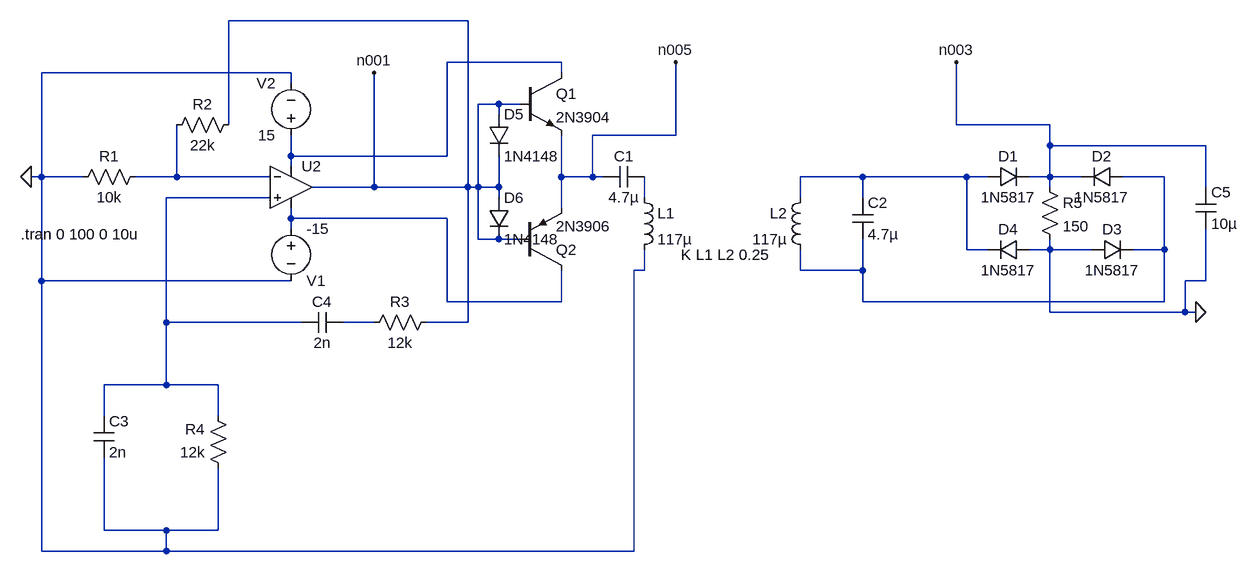
[diagram p0: schematic final simulation.asc]
final simulation.asc, the LTspice schematic file:
Version 4.1
SHEET 1 1472 960
WIRE -128 -128 -496 -128
WIRE 16 -64 -160 -64
WIRE -400 -48 -784 -48
WIRE 16 -48 16 -64
WIRE -400 -32 -400 -48
WIRE -80 0 -112 0
WIRE -48 0 -80 0
WIRE -80 16 -80 0
WIRE -496 32 -496 -128
WIRE 624 32 624 -64
WIRE 768 32 624 32
WIRE 192 48 192 -64
WIRE 192 48 64 48
WIRE 768 64 768 32
WIRE 1008 64 768 64
WIRE -400 80 -400 48
WIRE -160 80 -160 -64
WIRE -160 80 -400 80
WIRE -400 96 -400 80
WIRE -784 112 -784 -48
WIRE -784 112 -800 112
WIRE -720 112 -784 112
WIRE -576 112 -576 32
WIRE -576 112 -640 112
WIRE -432 112 -576 112
WIRE 16 112 16 48
WIRE 64 112 64 48
WIRE 64 112 16 112
WIRE 80 112 64 112
WIRE 480 112 384 112
WIRE 640 112 480 112
WIRE 672 112 640 112
WIRE 768 112 768 64
WIRE 768 112 736 112
WIRE 816 112 768 112
WIRE 944 112 880 112
WIRE -272 128 -272 -48
WIRE -272 128 -368 128
WIRE -128 128 -128 -128
WIRE -128 128 -272 128
WIRE -112 128 -112 0
WIRE -112 128 -128 128
WIRE -80 128 -80 80
WIRE -80 128 -112 128
WIRE 768 128 768 112
WIRE 1008 128 1008 64
WIRE -432 144 -592 144
WIRE -80 144 -80 128
WIRE 144 144 144 112
WIRE 384 144 384 112
WIRE 480 144 480 112
WIRE 16 160 16 112
WIRE -400 176 -400 160
WIRE -160 176 -400 176
WIRE -400 192 -400 176
WIRE -112 208 -112 128
WIRE -80 208 -112 208
WIRE -48 208 -80 208
WIRE 640 224 640 112
WIRE 672 224 640 224
WIRE 768 224 768 208
WIRE 768 224 736 224
WIRE 832 224 768 224
WIRE 944 224 944 112
WIRE 944 224 896 224
WIRE 144 256 144 224
WIRE 144 256 128 256
WIRE 384 256 384 224
WIRE 480 256 480 208
WIRE 480 256 384 256
WIRE -784 272 -784 112
WIRE -400 272 -784 272
WIRE 1008 272 1008 192
WIRE 1008 272 976 272
WIRE -160 304 -160 176
WIRE 16 304 16 256
WIRE 16 304 -160 304
WIRE 480 304 480 256
WIRE 944 304 944 224
WIRE 944 304 480 304
WIRE 768 320 768 224
WIRE 976 320 976 272
WIRE 976 320 768 320
WIRE 992 320 976 320
WIRE -592 336 -592 144
WIRE -384 336 -592 336
WIRE -272 336 -320 336
WIRE -128 336 -128 128
WIRE -128 336 -192 336
WIRE -592 432 -592 336
WIRE -592 432 -688 432
WIRE -512 432 -592 432
WIRE -688 480 -688 432
WIRE -512 480 -512 432
WIRE -688 656 -688 544
WIRE -592 656 -688 656
WIRE -512 656 -512 560
WIRE -512 656 -592 656
WIRE -784 688 -784 272
WIRE -592 688 -592 656
WIRE -592 688 -784 688
WIRE 128 688 128 256
WIRE 128 688 -592 688
FLAG -800 112 0
FLAG 992 320 0
FLAG 624 -64 n003
FLAG 192 -64 n005
FLAG -272 -48 n001
SYMBOL ind 128 128 R0
SYMATTR InstName L1
SYMATTR Value 117µ
SYMATTR Type ind
SYMBOL ind 400 128 M0
SYMATTR InstName L2
SYMATTR Value 117µ
SYMATTR Type ind
SYMBOL cap 144 96 R90
WINDOW 0 0 32 VBottom 2
WINDOW 3 32 32 VTop 2
SYMATTR InstName C1
SYMATTR Value 4.7µ
SYMBOL cap 464 144 R0
SYMATTR InstName C2
SYMATTR Value 4.7µ
SYMBOL voltage -400 176 R0
WINDOW 0 24 96 Left 2
WINDOW 3 24 16 Left 2
WINDOW 123 0 0 Left 0
WINDOW 39 0 0 Left 0
SYMATTR InstName V1
SYMATTR Value -15
SYMBOL voltage -400 64 R180
WINDOW 0 24 96 Left 2
WINDOW 3 24 16 Left 2
WINDOW 123 0 0 Left 0
WINDOW 39 0 0 Left 0
SYMATTR InstName V2
SYMATTR Value 15
SYMBOL res -624 96 R90
WINDOW 0 0 56 VBottom 2
WINDOW 3 32 56 VTop 2
SYMATTR InstName R1
SYMATTR Value 10k
SYMBOL res -480 16 R90
WINDOW 0 0 56 VBottom 2
WINDOW 3 32 56 VTop 2
SYMATTR InstName R2
SYMATTR Value 22k
SYMBOL res -176 320 R90
WINDOW 0 0 56 VBottom 2
WINDOW 3 32 56 VTop 2
SYMATTR InstName R3
SYMATTR Value 12k
SYMBOL res -496 576 R180
WINDOW 0 36 76 Left 2
WINDOW 3 36 40 Left 2
SYMATTR InstName R4
SYMATTR Value 12k
SYMBOL cap -704 480 R0
SYMATTR InstName C3
SYMATTR Value 2n
SYMBOL cap -320 320 R90
WINDOW 0 0 32 VBottom 2
WINDOW 3 32 32 VTop 2
SYMATTR InstName C4
SYMATTR Value 2n
SYMBOL diode 736 208 R90
WINDOW 0 0 32 VBottom 2
WINDOW 3 32 32 VTop 2
SYMATTR InstName D4
SYMATTR Value 1N5817
SYMBOL diode 880 96 R90
WINDOW 0 0 32 VBottom 2
WINDOW 3 32 32 VTop 2
SYMATTR InstName D2
SYMATTR Value 1N5817
SYMBOL diode 672 128 R270
WINDOW 0 32 32 VTop 2
WINDOW 3 0 32 VBottom 2
SYMATTR InstName D1
SYMATTR Value 1N5817
SYMBOL diode 832 240 R270
WINDOW 0 32 32 VTop 2
WINDOW 3 0 32 VBottom 2
SYMATTR InstName D3
SYMATTR Value 1N5817
SYMBOL OpAmps\\UniversalOpAmp2 -400 128 R0
SYMATTR InstName U2
SYMATTR Value2 Avol=100k GBW=10Meg Slew=9Meg
SYMATTR SpiceLine Ilimit=38m Rail=0 Vos=500u
SYMATTR SpiceLine2 En=0 Enk=0 In=0 Ink=0 Rin=300k
SYMBOL res 752 112 R0
SYMATTR InstName R5
SYMATTR Value 150
SYMBOL npn -48 -48 R0
SYMATTR InstName Q1
SYMATTR Value 2N3904
SYMBOL pnp -48 256 M180
SYMATTR InstName Q2
SYMATTR Value 2N3906
SYMBOL diode -96 16 R0
SYMATTR InstName D5
SYMATTR Value 1N4148
SYMBOL diode -96 144 R0
SYMATTR InstName D6
SYMATTR Value 1N4148
SYMBOL cap 992 128 R0
SYMATTR InstName C5
SYMATTR Value 10µ
TEXT 200 232 Left 2 !K L1 L2 0.25
TEXT -816 200 Left 2 !.tran 0 100 0 10u

The netlist it stands for:
* final simulation.asc
L1 N009 0 117µ
L2 N006 N007 117µ
C1 N009 n005 4.7µ
C2 N006 N007 4.7µ
V1 N010 0 -15
V2 N002 0 15
R1 N004 0 10k
R2 n001 N004 22k
R3 n001 N011 12k
R4 0 N008 12k
C3 N008 0 2n
C4 N011 N008 2n
D4 0 N006 1N5817
D2 N007 n003 1N5817
D1 N006 n003 1N5817
D3 0 N007 1N5817
X§U2 N008 N004 N002 N010 n001 level2 Avol=100k GBW=10Meg Slew=9Meg Ilimit=38m Rail=0 Vos=500u En=0 Enk=0 In=0 Ink=0 Rin=300k  ; pins In+ In- V+ V- OUT
R5 n003 0 150
Q1 N002 n001 n005 0 2N3904
Q2 N010 n001 n005 0 2N3906
D5 n001 n001 1N4148
D6 n001 n001 1N4148
C5 n003 0 10µ
.model D D
.lib standard.dio
.model NPN NPN
.model PNP PNP
.lib standard.bjt
K L1 L2 0.25
.tran 0 100 0 10u
.lib UniversalOpAmp2.lib
.backanno
.end